# Altium project Mobot.PrjPCB
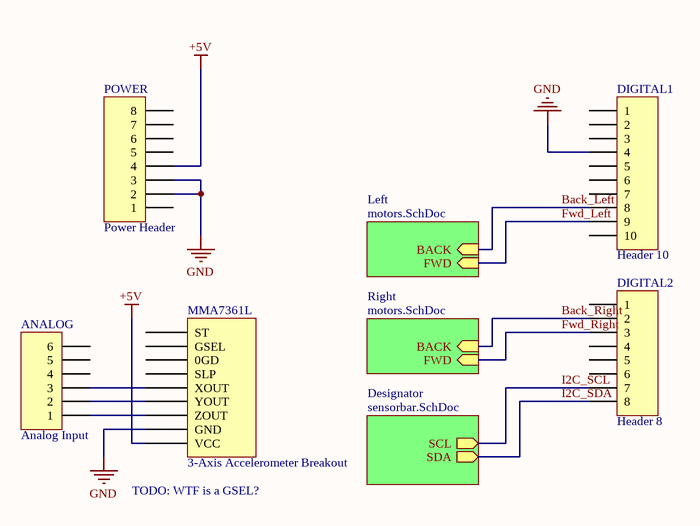
[diagram p0: top.SchDoc]
3 sheets, 28 parts. Net scope: hierarchical (ports join the sheet entries above them; power ports are global).
Sheets:
  top.SchDoc
    Left = motors.SchDoc
    Right = motors.SchDoc
    Designator = sensorbar.SchDoc

## Sheet top.SchDoc
size A

### Parts
ANALOG  Analog Input  [HDR1X6]
DIGITAL1  Header 10  [HDR1X10]
DIGITAL2  Header 8  [HDR1X8]
MMA7361L  3-Axis Accelerometer Breakout
POWER  Power Header  [HDR1X8]

### Sub-sheets
Designator = sensorbar.SchDoc: SDA (out), SCL (out)
Left = motors.SchDoc: FWD (in), BACK (in)
Right = motors.SchDoc: FWD (in), BACK (in)

### Nets
+5V: MMA7361L.VCC POWER.4
GND: DIGITAL1.4 MMA7361L.GND POWER.2 POWER.3
Back_Left: DIGITAL1.8 ; sheet Left/BACK
Back_Right: DIGITAL2.2 ; sheet Right/BACK
Fwd_Left: DIGITAL1.9 ; sheet Left/FWD
Fwd_Right: DIGITAL2.3 ; sheet Right/FWD
I2C_SCL: DIGITAL2.7 ; sheet Designator/SCL
I2C_SDA: DIGITAL2.8 ; sheet Designator/SDA
NetANALOG_1: ANALOG.1 MMA7361L.ZOUT
NetANALOG_2: ANALOG.2 MMA7361L.YOUT
NetANALOG_3: ANALOG.3 MMA7361L.XOUT

Not connected (* = marked no-connect by the designer): ANALOG 4 5 6; DIGITAL1 1 2 3 5 6 7 10; DIGITAL2 1 4 5 6; MMA7361L 0GD GSEL SLP ST; POWER 1 5 6 7 8

### Notes on the sheet
- (near MMA7361L) TODO: WTF is a GSEL?

### Library data of the parts
ANALOG = Header 6: Header, 6-Pin; LatestRevisionDate: 17-Jul-2002; LatestRevisionNote: Re-released for DXP Platform.; Publisher: Altium Limited
DIGITAL1 = Header 10: Header, 10-Pin; LatestRevisionDate: 17-Jul-2002; LatestRevisionNote: Re-released for DXP Platform.; Publisher: Altium Limited
DIGITAL2 POWER = Header 8: Header, 8-Pin; LatestRevisionDate: 17-Jul-2002; LatestRevisionNote: Re-released for DXP Platform.; Publisher: Altium Limited
MMA7361L = MMA7361L: ComponentURL: https://www.sparkfun.com/products/9652

## Sheet motors.SchDoc
size A
Used 2 times, as channels Left, Right. Parts and nets are listed once, with the designators drawn on the sheet.
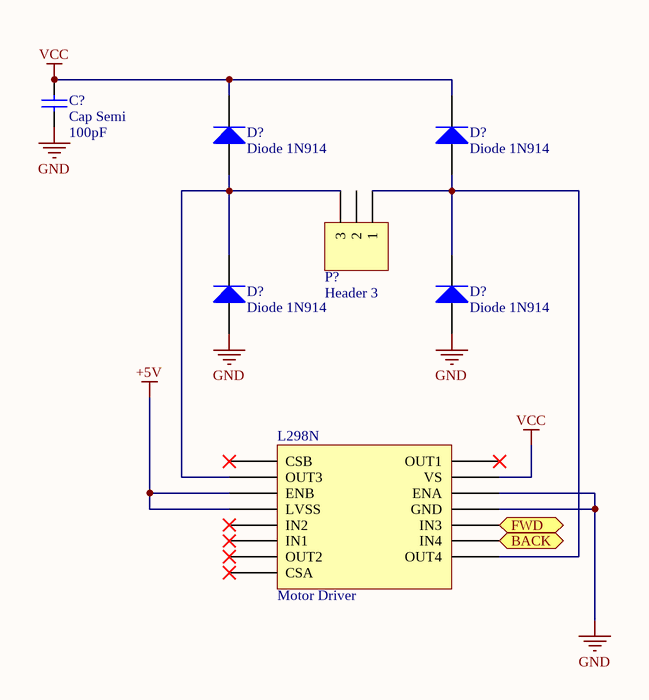
[diagram p1: motors.SchDoc]

### Parts
(Parts that share a designator on the sheet are numbered #1, #2 ... from top to bottom, then left to right.)
C?  Cap Semi  value 100pF  [C1206]
D?#1  Diode 1N914  [DO-35]
D?#2  Diode 1N914  [DO-35]
D?#3  Diode 1N914  [DO-35]
D?#4  Diode 1N914  [DO-35]
L298N  Motor Driver
P?  Header 3  [HDR1X3]

### Ports
BACK (in), FWD (in)

### Nets
+5V: L298N.ENB L298N.LVSS
GND: C?.1 D?#3.1(A) D?#4.1(A) L298N.ENA L298N.GND
VCC: C?.2 D?#1.2(K) D?#2.2(K) L298N.VS
BACK: L298N.IN4 ; port BACK
FWD: L298N.IN3 ; port FWD
NetD?#1_1: D?#1.1(A) D?#3.2(K) L298N.OUT3 P?.3
NetD?#2_1: D?#2.1(A) D?#4.2(K) L298N.OUT4 P?.1

Not connected (* = marked no-connect by the designer): L298N CSA* CSB* IN1* IN2* OUT1* OUT2*; P? 2

### Channels
Left: designators C?=C?_Left D?=D?_Left#3 D?=D?_Left#4 D?=D?_Left#1 D?=D?_Left#2 L298N=L298N_Left P?=P?_Left; ports BACK=Back_Left FWD=Fwd_Left
Right: designators C?=C?_Right D?=D?_Right#3 D?=D?_Right#4 D?=D?_Right#1 D?=D?_Right#2 L298N=L298N_Right P?=P?_Right; ports BACK=Back_Right FWD=Fwd_Right

### Library data of the parts
C? = Cap Semi: Capacitor (Semiconductor SIM Model); Published: 8-Jun-2000; LatestRevisionDate: 29-May-2009; LatestRevisionNote: IPC-7351 Footprint Added.; PackageReference: C1206; Publisher: Altium Limited; PackageDescription: Chip Capacitor
D?#1-D?#4 = Diode 1N914: High Conductance Fast Diode; Published: 8-Jun-2000; LatestRevisionDate: 17-Jul-2002; LatestRevisionNote: Re-released for DXP Platform.; DatasheetVersion: 1997; PackageReference: DO-35; Publisher: Altium Limited; PackageDescription: Diode, Axial; Body 3.8 x 1.9 mm (LxDia. max), Lead Dia. 0.53 mm (max); Code_JEDEC: DO-204-AH; ComponentLink1Description: Manufacturer Link; ComponentLink1URL: http://www.fairchildsemi.com/; ComponentLink2Description: Datasheet; ComponentLink2URL: http://www.fairchildsemi.com/ds/1N%2F1N4448.pdf
L298N = L298N: Dual Full Bridge Motor Driver; ComponentLink: http://www.sparkfun.com/datasheets/Components/General/L298N.pdf
P? = Header 3: Header, 3-Pin; LatestRevisionDate: 17-Jul-2002; LatestRevisionNote: Re-released for DXP Platform.; Publisher: Altium Limited

## Sheet sensorbar.SchDoc
size A
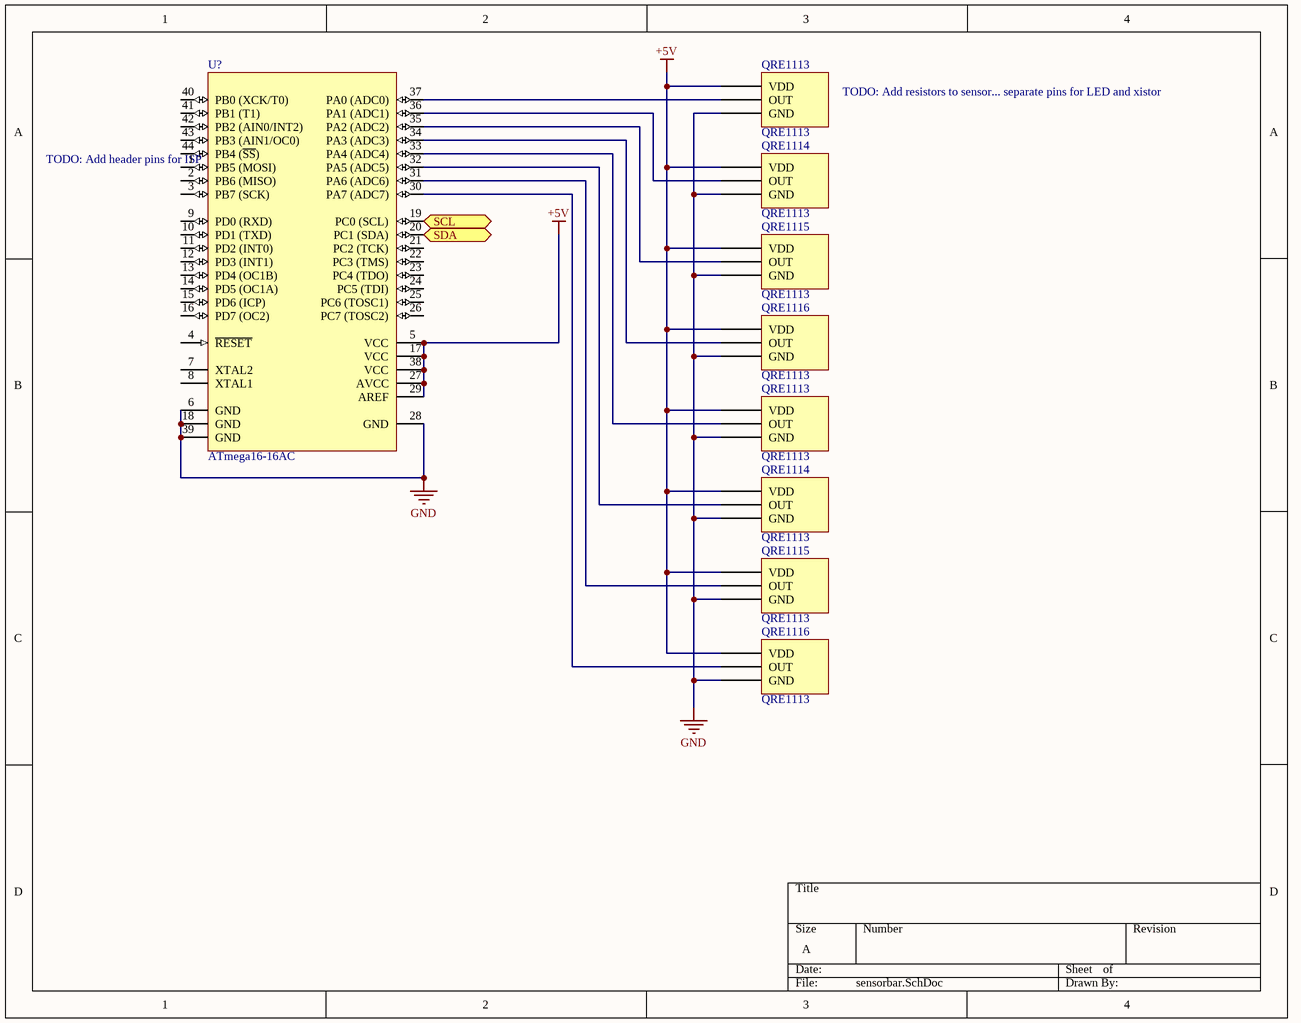
[diagram p2: sensorbar.SchDoc]

### Parts
(Parts that share a designator on the sheet are numbered #1, #2 ... from top to bottom, then left to right.)
QRE1113#1  QRE1113
QRE1113#2  QRE1113
QRE1114#1  QRE1113
QRE1114#2  QRE1113
QRE1115#1  QRE1113
QRE1115#2  QRE1113
QRE1116#1  QRE1113
QRE1116#2  QRE1113
U?  ATmega16-16AC  [44A_N]

### Ports
SCL (out), SDA (out)

### Nets
+5V: QRE1113#1.VDD QRE1113#2.VDD QRE1114#1.VDD QRE1114#2.VDD QRE1115#1.VDD QRE1115#2.VDD QRE1116#1.VDD QRE1116#2.VDD U?.5(VCC) U?.17(VCC) U?.27(AVCC) U?.29(AREF) U?.38(VCC)
GND: QRE1113#1.GND QRE1113#2.GND QRE1114#1.GND QRE1114#2.GND QRE1115#1.GND QRE1115#2.GND QRE1116#1.GND QRE1116#2.GND U?.6(GND) U?.18(GND) U?.28(GND) U?.39(GND)
I2C_SCL: U?.19(PC0_(SCL)) ; port SCL
I2C_SDA: U?.20(PC1_(SDA)) ; port SDA
NetQRE1113#1_OUT: QRE1113#1.OUT U?.37(PA0_(ADC0))
NetQRE1113#2_OUT: QRE1113#2.OUT U?.33(PA4_(ADC4))
NetQRE1114#1_OUT: QRE1114#1.OUT U?.36(PA1_(ADC1))
NetQRE1114#2_OUT: QRE1114#2.OUT U?.32(PA5_(ADC5))
NetQRE1115#1_OUT: QRE1115#1.OUT U?.35(PA2_(ADC2))
NetQRE1115#2_OUT: QRE1115#2.OUT U?.31(PA6_(ADC6))
NetQRE1116#1_OUT: QRE1116#1.OUT U?.34(PA3_(ADC3))
NetQRE1116#2_OUT: QRE1116#2.OUT U?.30(PA7_(ADC7))

Not connected (* = marked no-connect by the designer): U? 1(PB5_(MOSI)) 2(PB6_(MISO)) 3(PB7_(SCK)) 4(~{RESET}) 7(XTAL2) 8(XTAL1) 9(PD0_(RXD)) 10(PD1_(TXD)) 11(PD2_(INT0)) 12(PD3_(INT1)) 13(PD4_(OC1B)) 14(PD5_(OC1A)) 15(PD6_(ICP)) 16(PD7_(OC2)) 21(PC2_(TCK)) 22(PC3_(TMS)) 23(PC4_(TDO)) 24(PC5_(TDI)) 25(PC6_(TOSC1)) 26(PC7_(TOSC2)) 40(PB0_(XCK/T0)) 41(PB1_(T1)) 42(PB2_(AIN0/INT2)) 43(PB3_(AIN1/OC0)) 44(PB4_(~{SS}))

### Notes on the sheet
- TODO: Add resistors to sensor... separate pins for LED and xistor
- (near U?) TODO: Add header pins for ISP

### Library data of the parts
QRE1113#1 QRE1113#2 QRE1114#1 QRE1114#2 QRE1115#1 QRE1115#2 QRE1116#1 QRE1116#2 = QRE1113: Object Sensor
U? = ATmega16-16AC: 8-Bit AVR Microcontroller with 16K Bytes of In-System Programmable Flash Memory; Published: 17-Sep-2003; LatestRevisionDate: 13-Apr-2006; LatestRevisionNote: IPC-7351 Footprint Added.; DatasheetVersion: 2466E-AVR-10/02; PackageVersion: rev.B, Oct-2001; PackageReference: 44A; Publisher: Altium Limited; PackageDescription: 44-Pin Thin Quad Flat Pack 0.8 mm Pitch; ComponentLink1Description: Manufacturer Link; ComponentLink1URL: http://www.atmel.com; ComponentLink2Description: Datasheet; ComponentLink2URL: http://www.atmel.com/dyn/resources/prod_documents/doc2466.pdf

## Nets that join several sheets
+5V: top (MMA7361L.VCC POWER.4), Left (L298N_Left.ENB L298N_Left.LVSS), Right (L298N_Right.ENB L298N_Right.LVSS), sensorbar (13 pins)
GND: top (DIGITAL1.4 MMA7361L.GND POWER.2 POWER.3), Left (5 pins), Right (5 pins), sensorbar (12 pins)
VCC: Left (C?_Left.2 D?_Left#1.2 D?_Left#2.2 L298N_Left.VS), Right (C?_Right.2 D?_Right#1.2 D?_Right#2.2 L298N_Right.VS)
Back_Left: top (DIGITAL1.8), Left (L298N_Left.IN4)
Back_Right: top (DIGITAL2.2), Right (L298N_Right.IN4)
Fwd_Left: top (DIGITAL1.9), Left (L298N_Left.IN3)
Fwd_Right: top (DIGITAL2.3), Right (L298N_Right.IN3)
I2C_SCL: top (DIGITAL2.7), sensorbar (U?.19)
I2C_SDA: top (DIGITAL2.8), sensorbar (U?.20)